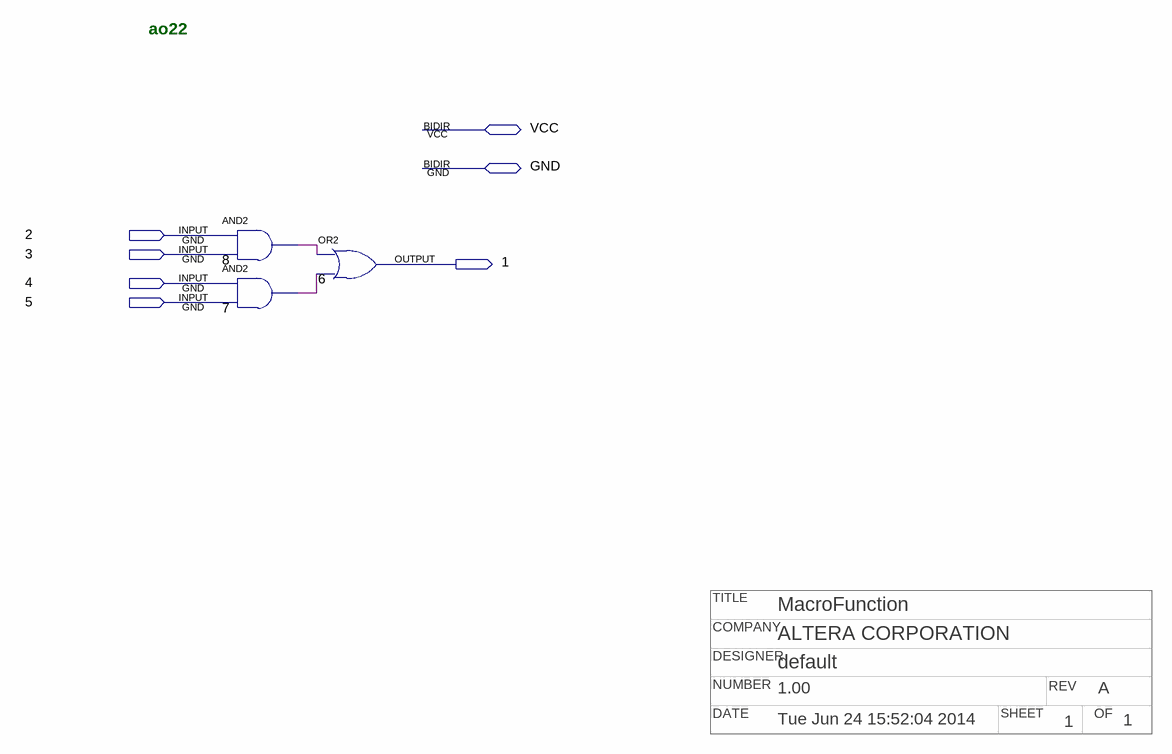
[diagram p0: schematic sheet]
// Quartus schematic npao22.bdf as structural Verilog: 3 symbols, 7 pins
// Title block: TITLE: MacroFunction; COMPANY: ALTERA CORPORATION; DESIGNER: default; NUMBER: 1.00; REV: A; DATE: Tue Jun 24 15:52:04 2014; SHEET: 1; OF: 1
module npao22 (
  input  \2 ,
  input  \3 ,
  input  \4 ,
  input  \5 ,
  inout  VCC,
  inout  GND,
  output \1 
);

  wire n7_out, n8_out;

  and u_8 (n8_out, \2 , \3 );
  and u_7 (n7_out, \4 , \5 );
  or u_6 (\1 , n8_out, n7_out);

  // Notes on the sheet:
  //   ao22
endmodule
